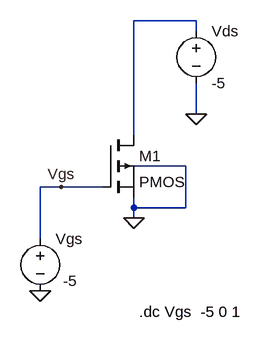
[diagram p0: schematic Lab1_PMOS.asc]
Lab1_PMOS.asc, the LTspice schematic file:
Version 4
SHEET 1 1088 816
WIRE -512 176 -608 176
WIRE -512 192 -512 176
WIRE -512 320 -512 272
WIRE -608 352 -608 176
WIRE -528 400 -608 400
WIRE -720 432 -752 432
WIRE -656 432 -720 432
WIRE -608 464 -608 448
WIRE -528 464 -528 400
WIRE -528 464 -608 464
WIRE -608 480 -608 464
WIRE -752 512 -752 432
FLAG -512 320 0
FLAG -608 480 0
FLAG -752 592 0
FLAG -720 432 Vgs
SYMBOL pmos -656 352 R0
SYMATTR InstName M1
SYMBOL voltage -752 496 R0
WINDOW 3 35 81 Left 2
SYMATTR Value -5
SYMATTR InstName Vgs
SYMBOL voltage -512 176 R0
SYMATTR InstName Vds
SYMATTR Value -5
TEXT -600 624 Left 2 !.dc Vgs  -5 0 1

The netlist it stands for:
* Lab1_PMOS.asc
M1 N001 Vgs 0 0 PMOS
Vgs Vgs 0 -5
Vds N001 0 -5
.model NMOS NMOS
.model PMOS PMOS
.lib standard.mos
.dc Vgs  -5 0 1
.backanno
.end